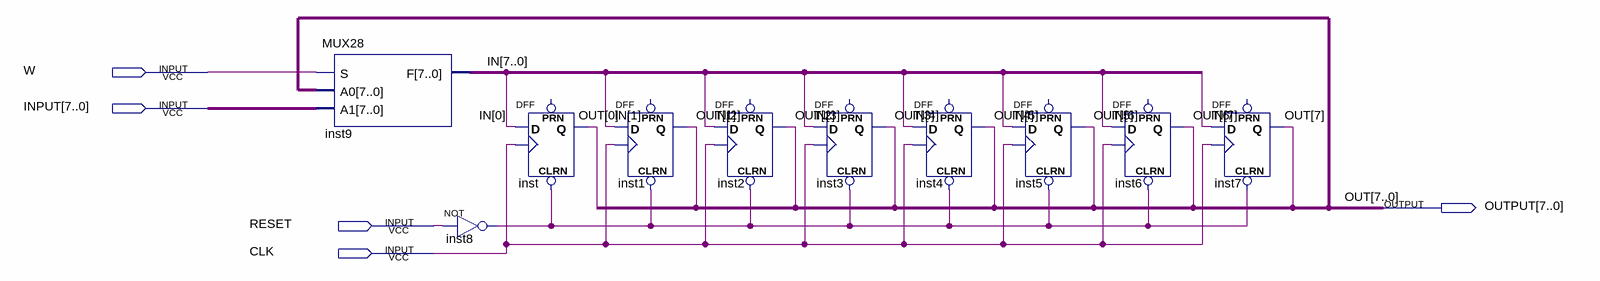
[diagram p0: schematic sheet]
// Quartus schematic REG_8BIT.bdf as structural Verilog: 10 symbols, 5 pins
module REG_8BIT (
  input  W,
  input  [7:0] INPUT,
  input  RESET,
  input  CLK,
  output [7:0] OUTPUT
);

  wire inst8_out;
  wire [7:0] IN;

  MUX28 inst9 (.S(W), .A0(OUTPUT), .A1(INPUT), .F(IN));
  not inst8 (inst8_out, RESET);
  DFF inst (.CLRN(inst8_out), .CLK(CLK), .D(IN[0]), .Q(OUTPUT[0]));  // open: PRN
  DFF inst1 (.CLRN(inst8_out), .CLK(CLK), .D(IN[1]), .Q(OUTPUT[1]));  // open: PRN
  DFF inst2 (.CLRN(inst8_out), .CLK(CLK), .D(IN[2]), .Q(OUTPUT[2]));  // open: PRN
  DFF inst3 (.CLRN(inst8_out), .CLK(CLK), .D(IN[3]), .Q(OUTPUT[3]));  // open: PRN
  DFF inst4 (.CLRN(inst8_out), .CLK(CLK), .D(IN[4]), .Q(OUTPUT[4]));  // open: PRN
  DFF inst5 (.CLRN(inst8_out), .CLK(CLK), .D(IN[5]), .Q(OUTPUT[5]));  // open: PRN
  DFF inst6 (.CLRN(inst8_out), .CLK(CLK), .D(IN[6]), .Q(OUTPUT[6]));  // open: PRN
  DFF inst7 (.CLRN(inst8_out), .CLK(CLK), .D(IN[7]), .Q(OUTPUT[7]));  // open: PRN

  // Other names for the same wires on the sheet: OUT[7:0] = OUTPUT
endmodule
